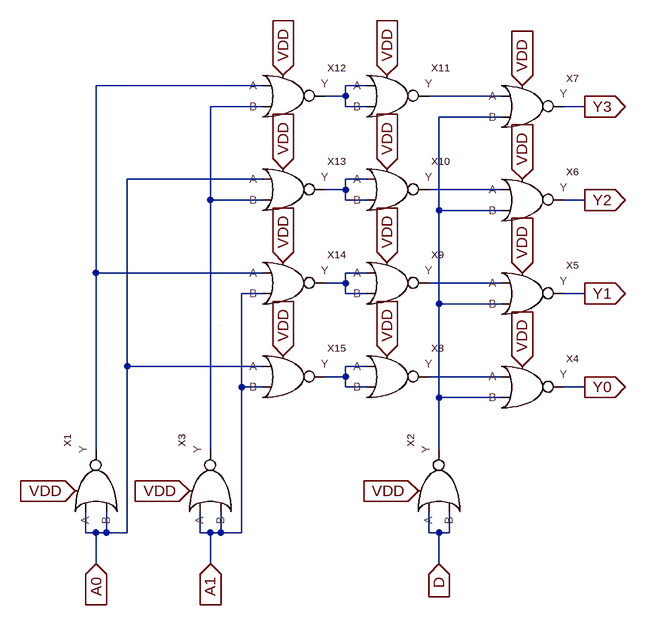
[diagram p0: schematic demux1to4.asc]
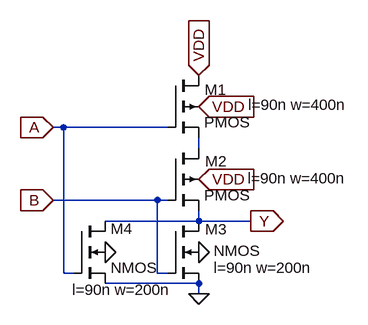
[diagram p1: sub-circuit nor.asc]
demux1to4.asc, the LTspice schematic file:
Version 4
SHEET 1 880 680
WIRE 64 -368 -192 -368
WIRE 224 -368 192 -368
WIRE 192 -352 192 -368
WIRE 192 -352 160 -352
WIRE 432 -352 320 -352
WIRE 64 -336 -16 -336
WIRE 192 -336 192 -352
WIRE 224 -336 192 -336
WIRE 560 -336 528 -336
WIRE 432 -320 336 -320
WIRE 64 -224 -144 -224
WIRE 224 -224 192 -224
WIRE 192 -208 192 -224
WIRE 192 -208 160 -208
WIRE 432 -208 320 -208
WIRE -16 -192 -16 -336
WIRE 64 -192 -16 -192
WIRE 192 -192 192 -208
WIRE 224 -192 192 -192
WIRE 560 -192 528 -192
WIRE 336 -176 336 -320
WIRE 432 -176 336 -176
WIRE -192 -80 -192 -368
WIRE 64 -80 -192 -80
WIRE 224 -80 192 -80
WIRE 192 -64 192 -80
WIRE 192 -64 160 -64
WIRE 432 -64 320 -64
WIRE 64 -48 32 -48
WIRE 192 -48 192 -64
WIRE 224 -48 192 -48
WIRE 560 -48 528 -48
WIRE 336 -32 336 -176
WIRE 432 -32 336 -32
WIRE -144 64 -144 -224
WIRE 64 64 -144 64
WIRE 224 64 192 64
WIRE 192 80 192 64
WIRE 192 80 160 80
WIRE 432 80 320 80
WIRE 32 96 32 -48
WIRE 64 96 32 96
WIRE 192 96 192 80
WIRE 224 96 192 96
WIRE 560 96 528 96
WIRE 336 112 336 -32
WIRE 432 112 336 112
WIRE -192 192 -192 -80
WIRE -16 192 -16 -192
WIRE 336 192 336 112
WIRE -208 320 -208 288
WIRE -192 320 -208 320
WIRE -176 320 -176 288
WIRE -176 320 -192 320
WIRE -144 320 -144 64
WIRE -144 320 -176 320
WIRE -32 320 -32 288
WIRE -16 320 -32 320
WIRE 0 320 0 288
WIRE 0 320 -16 320
WIRE 32 320 32 96
WIRE 32 320 0 320
WIRE 320 320 320 288
WIRE 336 320 320 320
WIRE 352 320 352 288
WIRE 352 320 336 320
WIRE -192 368 -192 320
WIRE -16 368 -16 320
WIRE 336 368 336 320
WIRE 0 0 0 0
FLAG 560 96 Y0
IOPIN 560 96 Out
FLAG 560 -48 Y1
IOPIN 560 -48 Out
FLAG 560 -192 Y2
IOPIN 560 -192 Out
FLAG 560 -336 Y3
IOPIN 560 -336 Out
FLAG -192 368 A0
IOPIN -192 368 In
FLAG -16 368 A1
IOPIN -16 368 In
FLAG -48 256 VDD
IOPIN -48 256 In
FLAG 336 368 D
IOPIN 336 368 In
FLAG -224 256 VDD
IOPIN -224 256 In
FLAG 304 256 VDD
IOPIN 304 256 In
FLAG 464 64 VDD
IOPIN 464 64 In
FLAG 464 -80 VDD
IOPIN 464 -80 In
FLAG 464 -224 VDD
IOPIN 464 -224 In
FLAG 464 -368 VDD
IOPIN 464 -368 In
FLAG 256 -384 VDD
IOPIN 256 -384 In
FLAG 256 -240 VDD
IOPIN 256 -240 In
FLAG 256 -96 VDD
IOPIN 256 -96 In
FLAG 256 48 VDD
IOPIN 256 48 In
FLAG 96 -384 VDD
IOPIN 96 -384 In
FLAG 96 -240 VDD
IOPIN 96 -240 In
FLAG 96 -96 VDD
IOPIN 96 -96 In
FLAG 96 48 VDD
IOPIN 96 48 In
SYMBOL nor -192 256 R270
SYMATTR InstName X1
SYMBOL nor -16 256 R270
SYMATTR InstName X3
SYMBOL nor 336 256 R270
SYMATTR InstName X2
SYMBOL nor 464 96 R0
SYMATTR InstName X4
SYMBOL nor 464 -48 R0
SYMATTR InstName X5
SYMBOL nor 464 -192 R0
SYMATTR InstName X6
SYMBOL nor 464 -336 R0
SYMATTR InstName X7
SYMBOL nor 256 80 R0
SYMATTR InstName X8
SYMBOL nor 256 -64 R0
SYMATTR InstName X9
SYMBOL nor 256 -208 R0
SYMATTR InstName X10
SYMBOL nor 256 -352 R0
SYMATTR InstName X11
SYMBOL nor 96 -352 R0
SYMATTR InstName X12
SYMBOL nor 96 -208 R0
SYMATTR InstName X13
SYMBOL nor 96 -64 R0
SYMATTR InstName X14
SYMBOL nor 96 80 R0
SYMATTR InstName X15

nor.asc, the sub-circuit schematic file:
Version 4
SHEET 1 880 680
WIRE 16 -176 0 -176
WIRE 176 -176 16 -176
WIRE 224 -144 224 -160
WIRE 160 -64 0 -64
WIRE 176 -64 160 -64
WIRE 224 -32 224 -48
WIRE 224 -32 80 -32
WIRE 304 -32 224 -32
WIRE 16 48 16 -176
WIRE 32 48 16 48
WIRE 160 48 160 -64
WIRE 176 48 160 48
WIRE 224 64 80 64
WIRE 224 80 224 64
FLAG 0 -176 A
IOPIN 0 -176 In
FLAG 0 -64 B
IOPIN 0 -64 In
FLAG 224 -256 VDD
IOPIN 224 -256 In
FLAG 304 -32 Y
IOPIN 304 -32 Out
FLAG 224 -208 VDD
IOPIN 224 -208 In
FLAG 224 -96 VDD
IOPIN 224 -96 In
FLAG 224 16 0
FLAG 80 16 0
FLAG 224 80 0
SYMBOL pmos4 176 -256 R0
WINDOW 123 124 45 Left 2
WINDOW 0 57 22 Left 2
SYMATTR Value2 l=90n w=400n
SYMATTR InstName M1
SYMBOL pmos4 176 -144 R0
WINDOW 123 123 46 Left 2
WINDOW 0 58 20 Left 2
SYMATTR Value2 l=90n w=400n
SYMATTR InstName M2
SYMBOL nmos4 176 -32 R0
WINDOW 123 71 72 Left 2
WINDOW 0 58 13 Left 2
WINDOW 3 71 46 Left 2
SYMATTR Value2 l=90n w=200n
SYMATTR InstName M3
SYMBOL nmos4 32 -32 R0
WINDOW 123 -3 106 Left 2
WINDOW 0 56 12 Left 2
SYMATTR Value2 l=90n w=200n
SYMATTR InstName M4

The netlist it stands for:
* demux1to4.asc
XX1 A0 A0 VDD N001 nor
XX3 A1 A1 VDD N004 nor
XX2 D D VDD N005 nor
XX4 N011 N005 VDD Y0 nor
XX5 N009 N005 VDD Y1 nor
XX6 N007 N005 VDD Y2 nor
XX7 N003 N005 VDD Y3 nor
XX8 N010 N010 VDD N011 nor
XX9 N008 N008 VDD N009 nor
XX10 N006 N006 VDD N007 nor
XX11 N002 N002 VDD N003 nor
XX12 N001 N004 VDD N002 nor
XX13 A0 N004 VDD N006 nor
XX14 N001 A1 VDD N008 nor
XX15 A0 A1 VDD N010 nor

* block symbol definitions
.subckt nor A B VDD Y
M1 VDD A N001 VDD PMOS l=90n w=400n
M2 N001 B Y VDD PMOS l=90n w=400n
M3 Y B 0 0 NMOS l=90n w=200n
M4 Y A 0 0 NMOS l=90n w=200n
.ends nor

.model NMOS NMOS
.model PMOS PMOS
.lib standard.mos
.backanno
.end